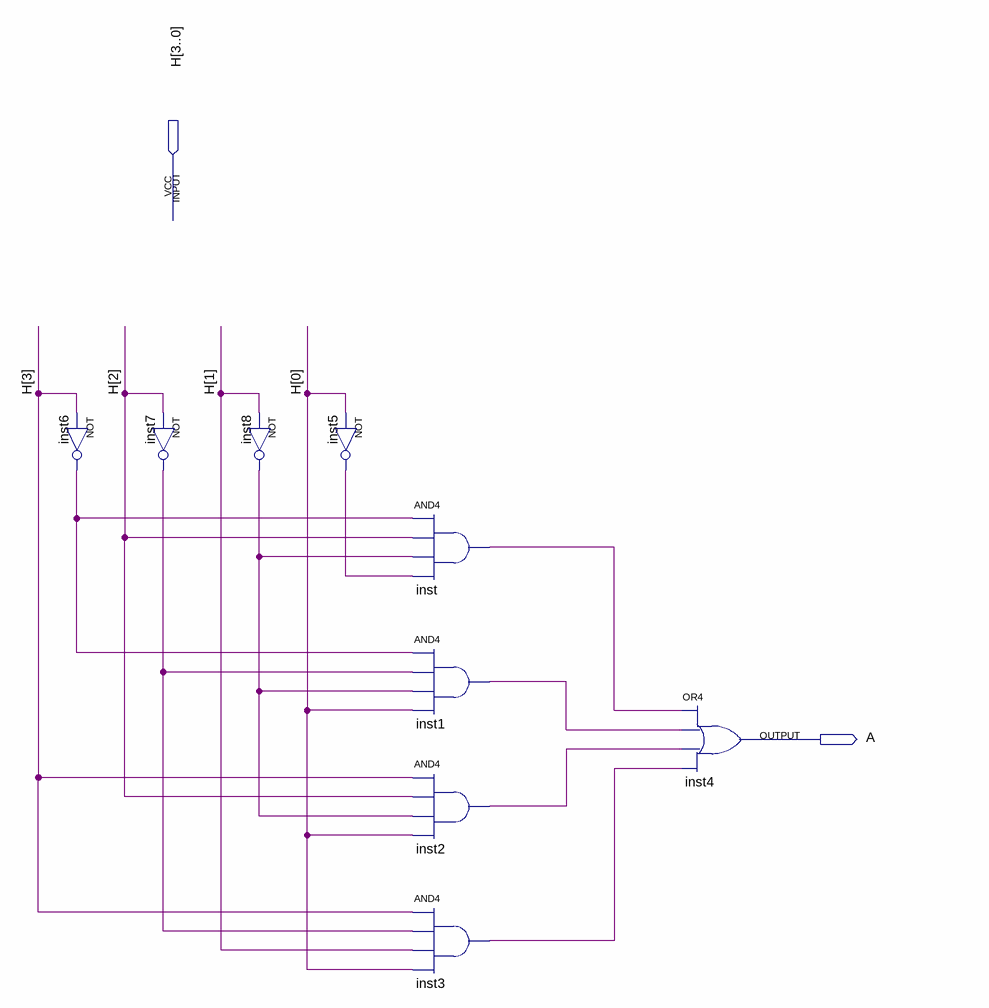
[diagram p0: schematic sheet]
// Quartus schematic A_Logic.bdf as structural Verilog: 9 symbols, 2 pins
module A_Logic (
  input  [3:0] H,
  output A
);

  wire inst1_out, inst2_out, inst3_out, inst5_out, inst6_out, inst7_out, inst8_out, inst_out;

  not inst6 (inst6_out, H[3]);
  not inst7 (inst7_out, H[2]);
  not inst8 (inst8_out, H[1]);
  not inst5 (inst5_out, H[0]);
  and inst (inst_out, inst6_out, H[2], inst8_out, inst5_out);
  and inst1 (inst1_out, inst6_out, inst7_out, inst8_out, H[0]);
  and inst2 (inst2_out, H[3], H[2], inst8_out, H[0]);
  and inst3 (inst3_out, H[3], inst7_out, H[1], H[0]);
  or inst4 (A, inst_out, inst1_out, inst2_out, inst3_out);
endmodule
